# EasyEDA schematic Tortoise Matrix Test Board schematic.json
TITLE: Sheet_1; REV: 1.0; Date: 2019-07-02; Sheet: 1/1; Drawn By: jwkelly49; Company: Your Company
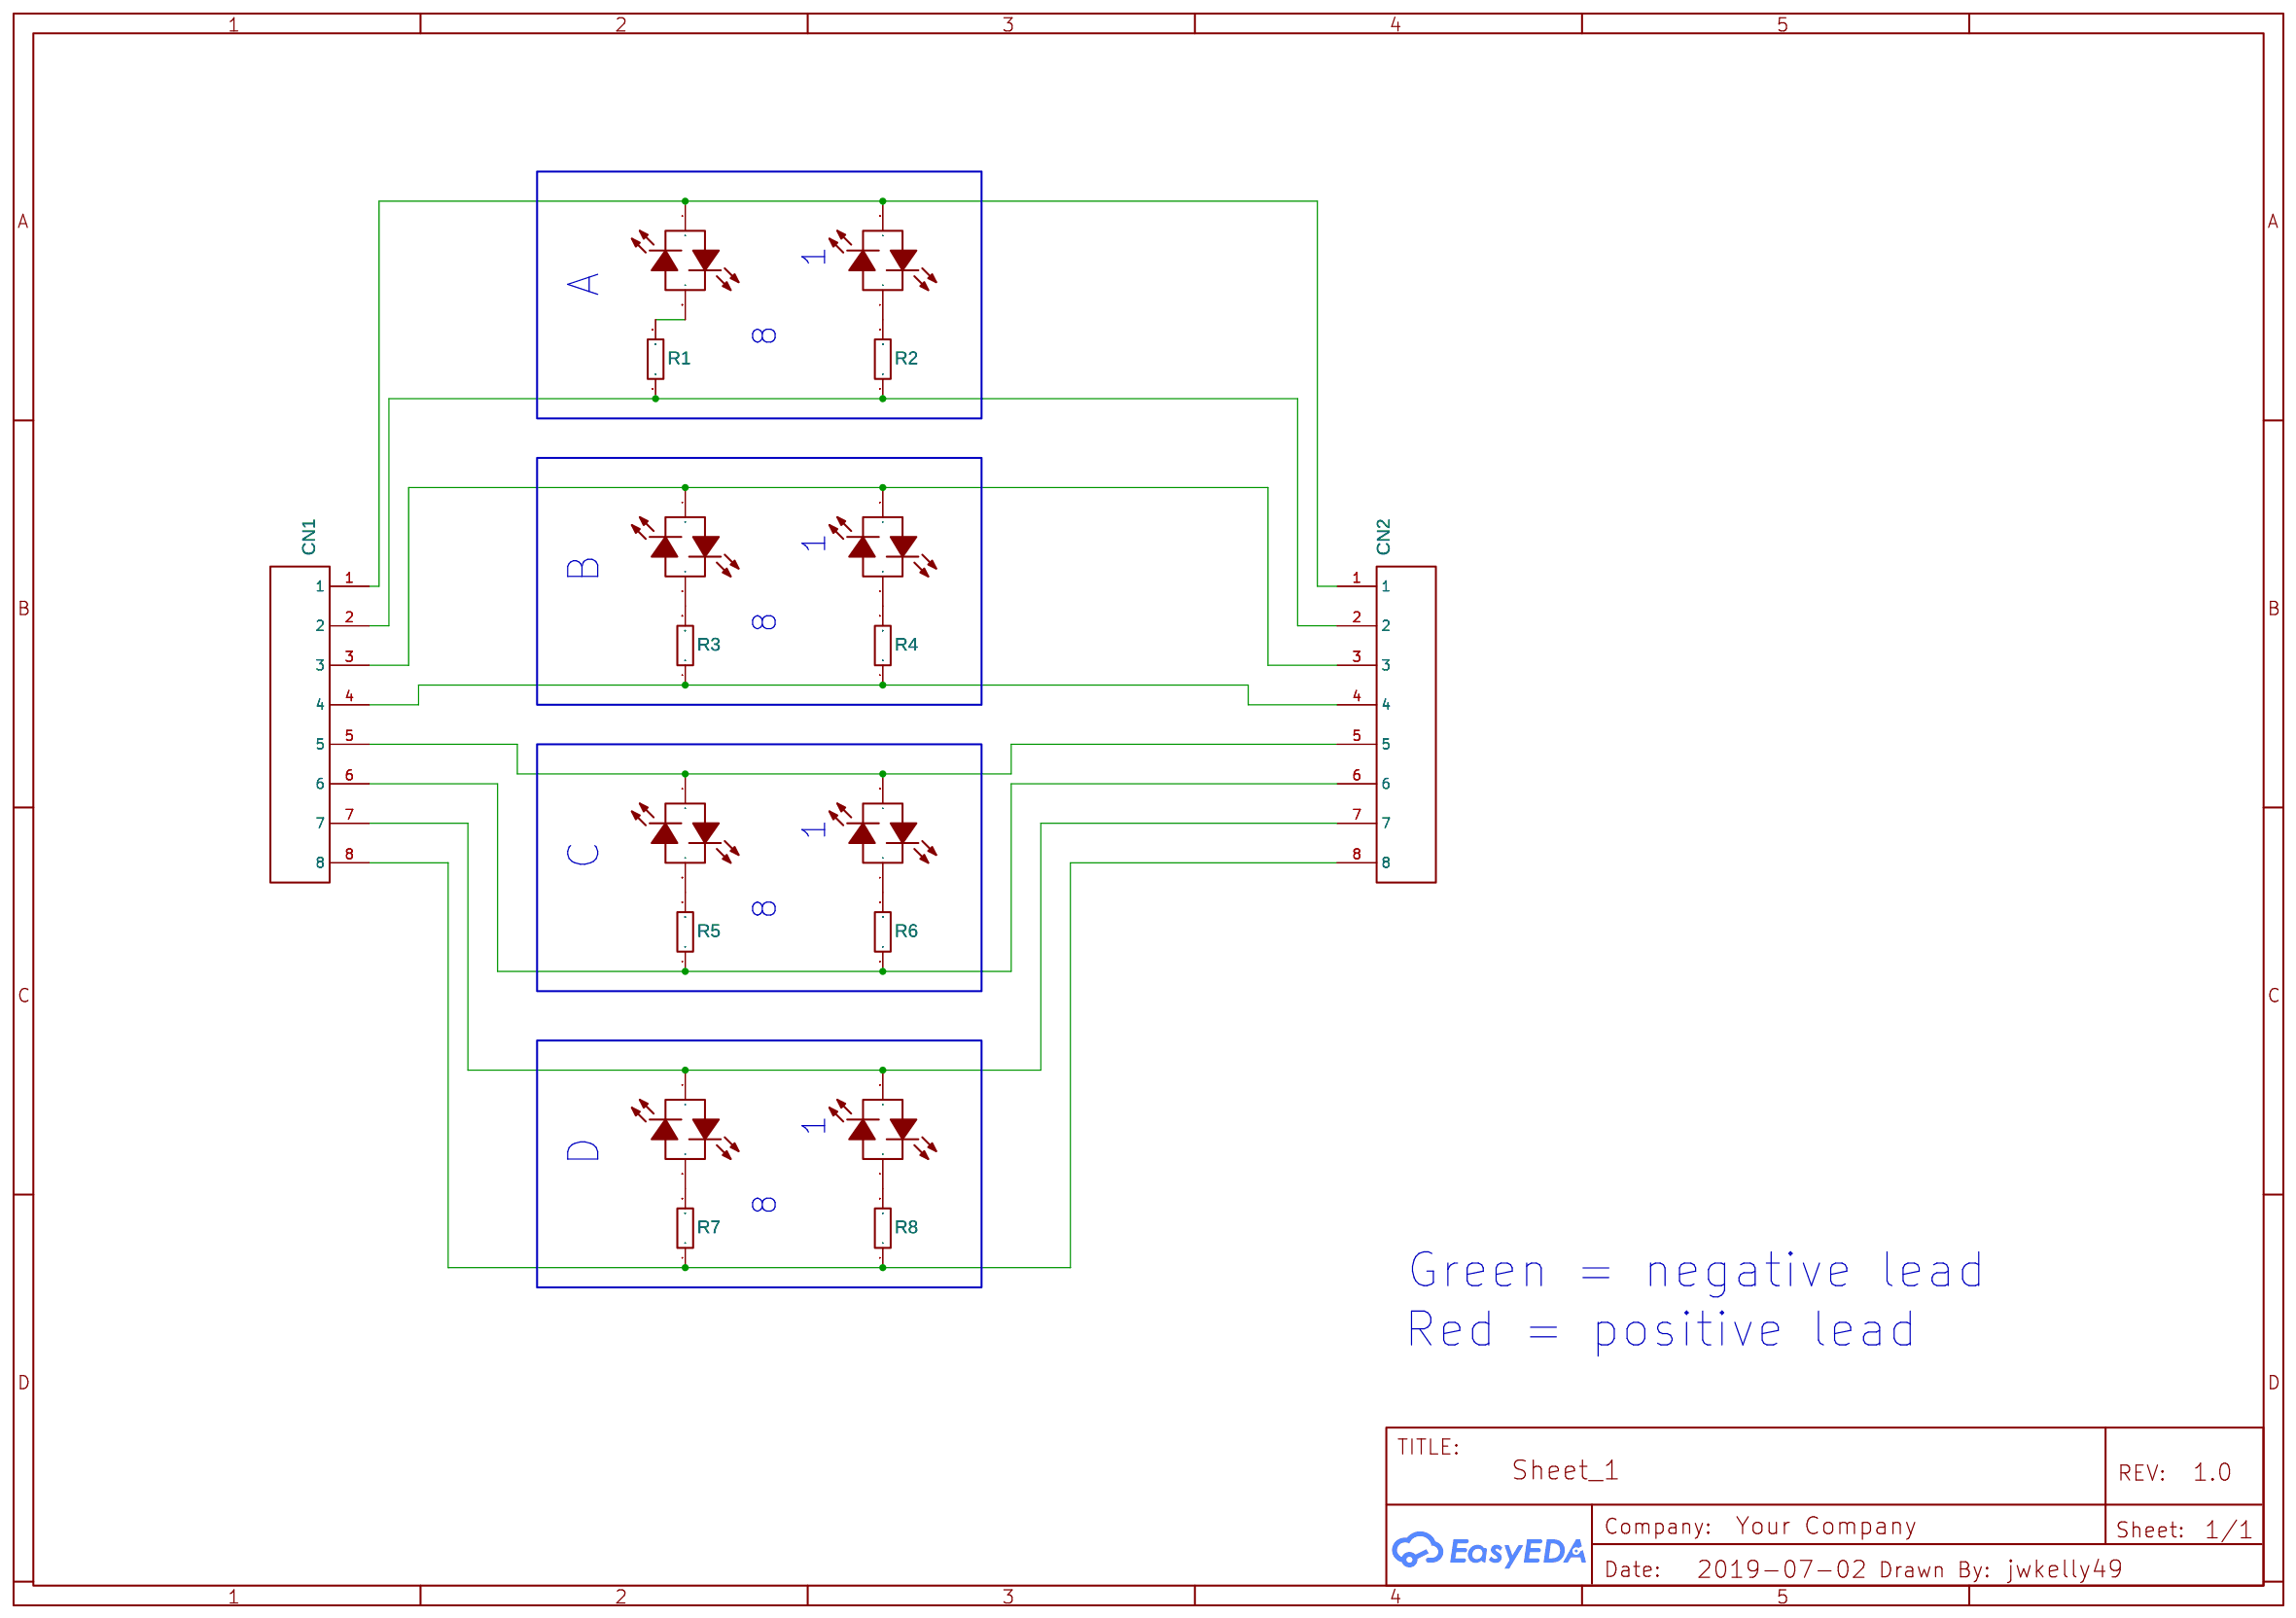
[diagram p0: schematic sheet]

## Parts
CN1  WJ25C-B-7.62-8P-13-00A  [WJ25C-B-7.62-8P]
CN2  WJ25C-B-7.62-8P-13-00A  [WJ25C-B-7.62-8P]
LED1  LTL-293SJW  [LED-5MM/2.54]
LED2  LTL-293SJW  [LED-5MM/2.54]
LED3  LTL-293SJW  [LED-5MM/2.54]
LED4  LTL-293SJW  [LED-5MM/2.54]
LED5  LTL-293SJW  [LED-5MM/2.54]
LED6  LTL-293SJW  [LED-5MM/2.54]
LED7  LTL-293SJW  [LED-5MM/2.54]
LED8  LTL-293SJW  [LED-5MM/2.54]
R1  270  [AXIAL-7.1X2.3(1/2W)]
R2  270  [AXIAL-7.1X2.3(1/2W)]
R3  270  [AXIAL-7.1X2.3(1/2W)]
R4  270  [AXIAL-7.1X2.3(1/2W)]
R5  270  [AXIAL-7.1X2.3(1/2W)]
R6  270  [AXIAL-7.1X2.3(1/2W)]
R7  270  [AXIAL-7.1X2.3(1/2W)]
R8  270  [AXIAL-7.1X2.3(1/2W)]

## Library data of the parts
CN1 CN2 = -: Supplier: LCSC; Manufacturer: ReliaPro; image: //image.lceda.cn/szlcsc/C49492.jpg; Supplier Part: C49492
LED1 LED3 LED5 LED7 = -: Supplier: LCSC; Manufacturer: LITEON; Contributor: LCSC; Supplier Part: C125079; Package Display: No
LED2 LED4 LED6 LED8 = -: Supplier: LCSC; Manufacturer: LITEON; Contributor: LCSC; Supplier Part: C125079
R1-R8 = MFS1/2CCT52A2700F: Supplier: LCSC; Supplier Part: C202436; Manufacturer: KOA Speer Elec; Contributor: LCSC

## Nets
Net-(CN1-1): CN1.1 CN2.1 LED1.1(A) LED2.2(K)
Net-(CN1-2): CN1.2 CN2.2 R1.1 R2.1
Net-(CN1-3): CN1.3 CN2.3 LED3.1(A) LED4.2(K)
Net-(CN1-4): CN1.4 CN2.4 R3.1 R4.1
Net-(CN1-5): CN1.5 CN2.5 LED5.1(A) LED6.2(K)
Net-(CN1-6): CN1.6 CN2.6 R5.1 R6.1
Net-(CN1-7): CN1.7 CN2.7 LED7.1(A) LED8.2(K)
Net-(CN1-8): CN1.8 CN2.8 R7.1 R8.1
Net-(LED1-2): LED1.2(K) R1.2
Net-(LED2-1): LED2.1(A) R2.2
Net-(LED3-2): LED3.2(K) R3.2
Net-(LED4-1): LED4.1(A) R4.2
Net-(LED5-2): LED5.2(K) R5.2
Net-(LED6-1): LED6.1(A) R6.2
Net-(LED7-2): LED7.2(K) R7.2
Net-(LED8-1): LED8.1(A) R8.2

## Notes on the sheet
- 1
- A
- 8
- 1
- B
- 8
- 1
- C
- 8
- 1
- D
- 8
- Green = negative lead
- Red = positive lead
